# EAGLE design PETKey_Arduino (EAGLE 7.7.0)
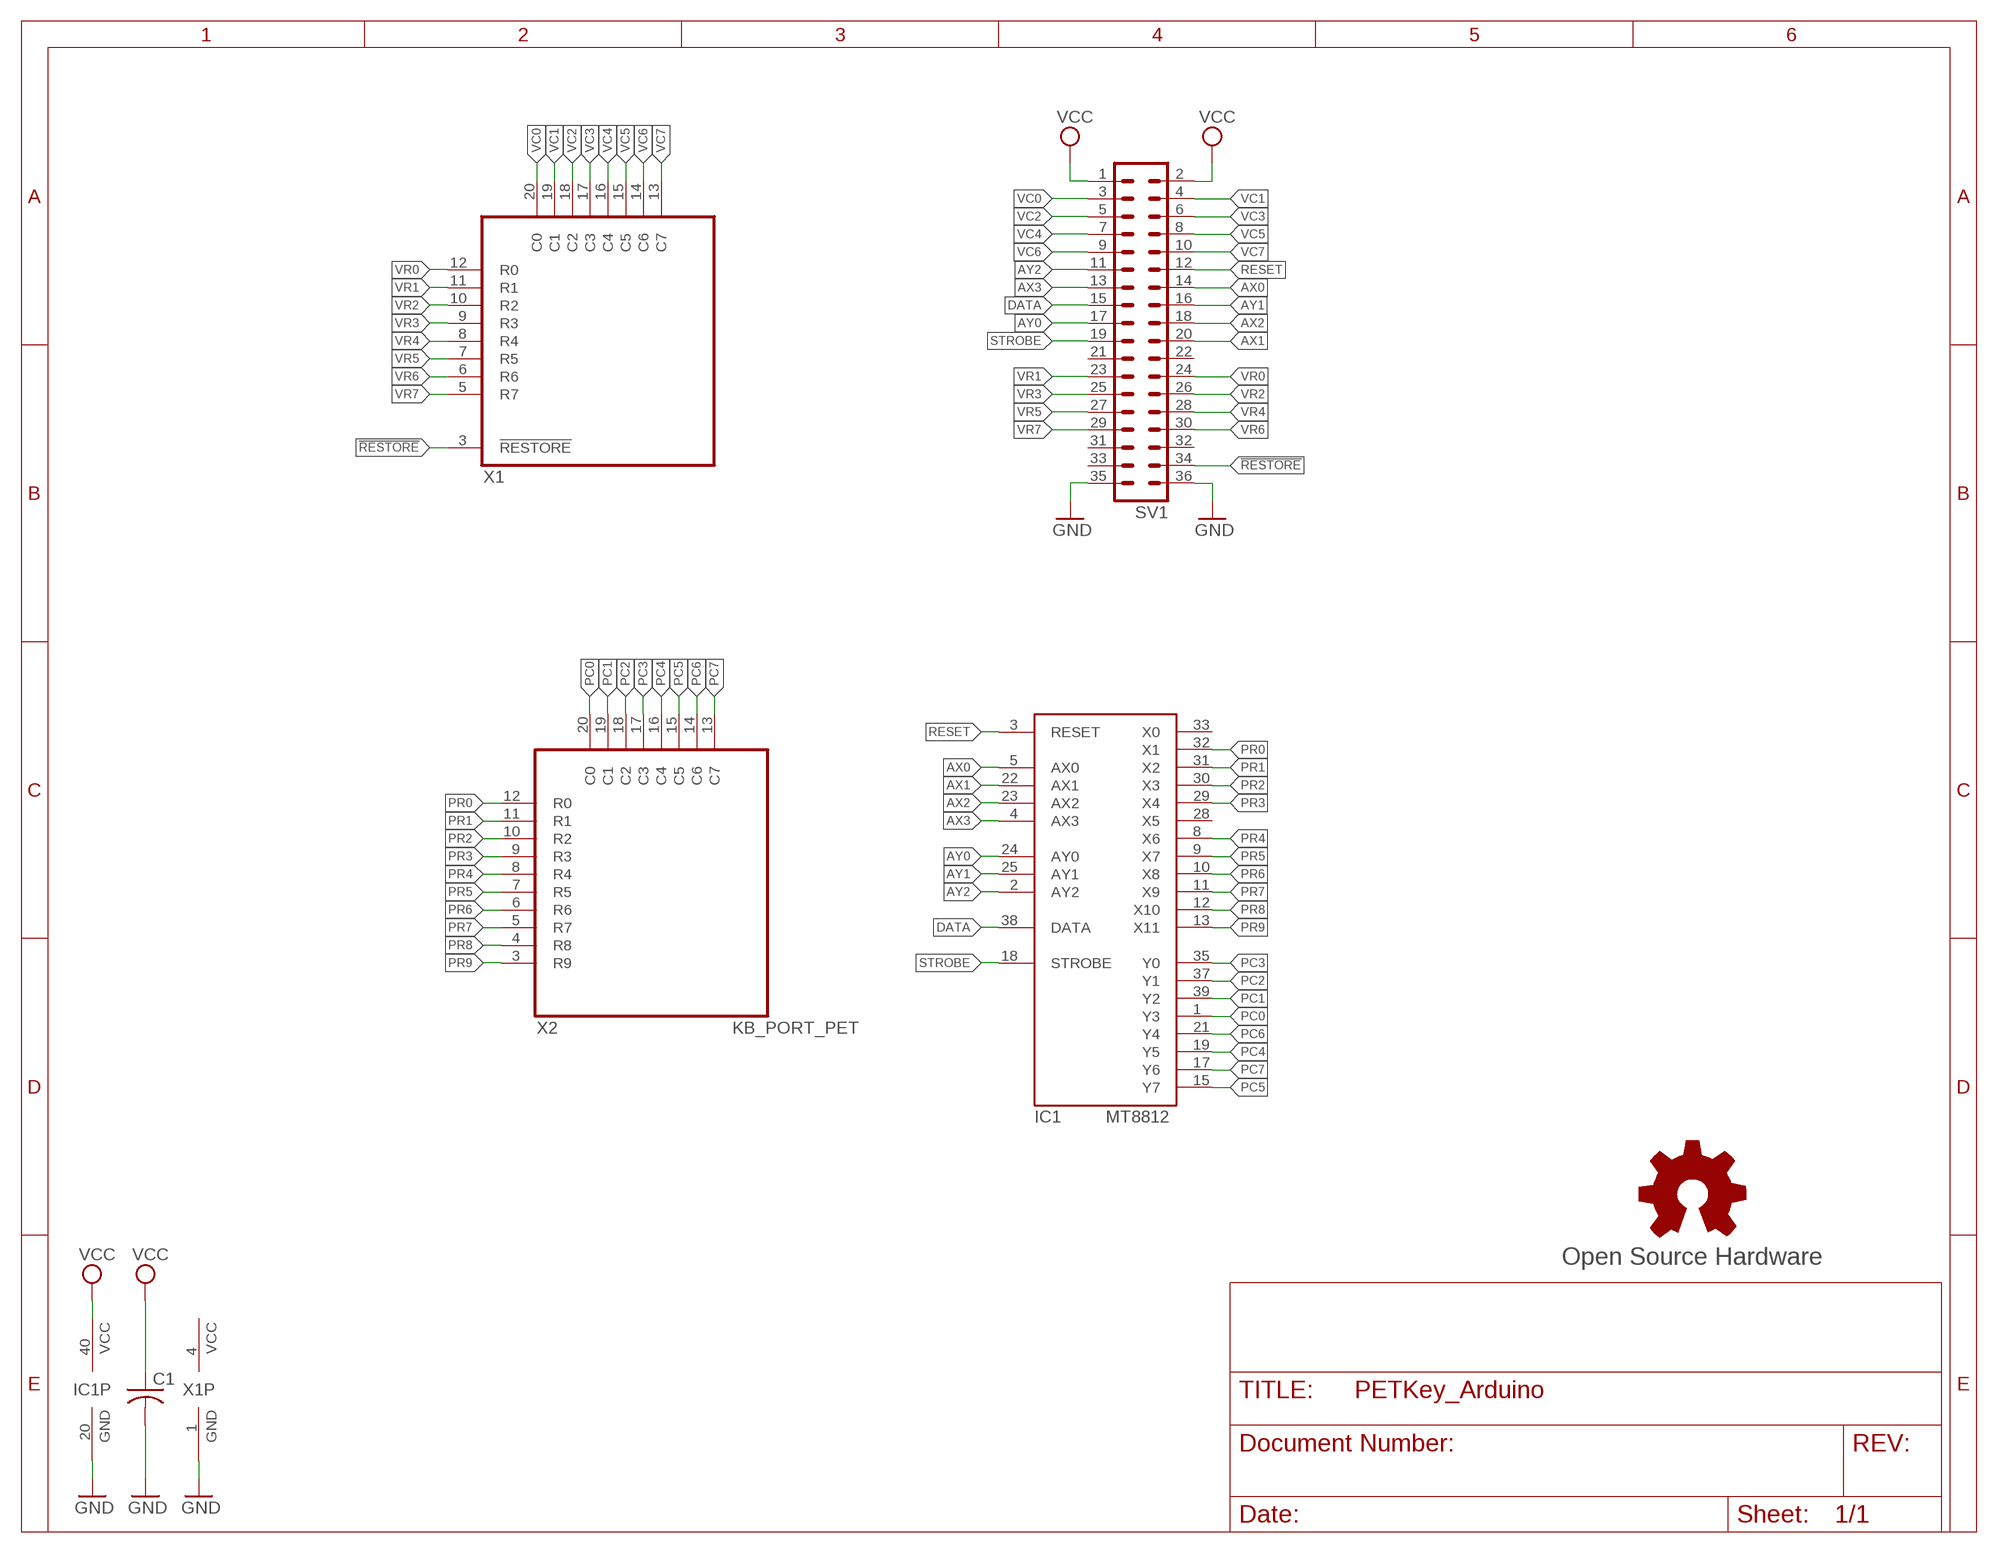
[diagram p0: schematic, sheet 1]

## Parts
C1  C-US025-025X050  [C025-025X050]
GOLD_ORB_SM1  Open Source Hardware  OSHWLOGOLOGO8MM  [OSHW_8MM]
IC1  MT8812  [DIP40]
SV1  MA18-2  [MA18-2]
X1  KB_PORT_VIC/64  [MA20-1_KEYED]
X2  KB_PORT_PET  [MA20-1_KEYED]

## Nets
!RESTORE: SV1.34 X1.3(!RESTORE)
AX0: IC1.5(AX0) SV1.14
AX1: IC1.22(AX1) SV1.20
AX2: IC1.23(AX2) SV1.18
AX3: IC1.4(AX3) SV1.13
AY0: IC1.24(AY0) SV1.17
AY1: IC1.25(AY1) SV1.16
AY2: IC1.2(AY2) SV1.11
DATA: IC1.38(DATA) SV1.15
GND: C1.2 IC1.20(GND) SV1.35 SV1.36 X1.1(GND)
PC0: IC1.1(Y3) X2.20(C0)
PC1: IC1.39(Y2) X2.19(C1)
PC2: IC1.37(Y1) X2.18(C2)
PC3: IC1.35(Y0) X2.17(C3)
PC4: IC1.19(Y5) X2.16(C4)
PC5: IC1.15(Y7) X2.15(C5)
PC6: IC1.21(Y4) X2.14(C6)
PC7: IC1.17(Y6) X2.13(C7)
PR0: IC1.32(X1) X2.12(R0)
PR1: IC1.31(X2) X2.11(R1)
PR2: IC1.30(X3) X2.10(R2)
PR3: IC1.29(X4) X2.9(R3)
PR4: IC1.8(X6) X2.8(R4)
PR5: IC1.9(X7) X2.7(R5)
PR6: IC1.10(X8) X2.6(R6)
PR7: IC1.11(X9) X2.5(R7)
PR8: IC1.12(X10) X2.4(R8)
PR9: IC1.13(X11) X2.3(R9)
RESET: IC1.3(RESET) SV1.12
STROBE: IC1.18(STROBE) SV1.19
VC0: SV1.3 X1.20(C0)
VC1: SV1.4 X1.19(C1)
VC2: SV1.5 X1.18(C2)
VC3: SV1.6 X1.17(C3)
VC4: SV1.7 X1.16(C4)
VC5: SV1.8 X1.15(C5)
VC6: SV1.9 X1.14(C6)
VC7: SV1.10 X1.13(C7)
VCC: C1.1 IC1.40(VCC) SV1.1 SV1.2
VR0: SV1.24 X1.12(R0)
VR1: SV1.23 X1.11(R1)
VR2: SV1.26 X1.10(R2)
VR3: SV1.25 X1.9(R3)
VR4: SV1.28 X1.8(R4)
VR5: SV1.27 X1.7(R5)
VR6: SV1.30 X1.6(R6)
VR7: SV1.29 X1.5(R7)
Unconnected: IC1.28(X5) IC1.33(X0) SV1.21 SV1.22 SV1.31 SV1.32 SV1.33

## Power pins joined to a net without a drawn wire
GND: X2.1(GND)
VCC: X1.4(VCC)

## Library data of the parts
C1 = resistor:C-US: CAPACITOR, American symbol
GOLD_ORB_SM1 = oshw:OSHWLOGO: The OSHW logo for PCB layout
IC1 = MT8812:MT8812
SV1 = con-lstb-rp:MA18-2: PIN HEADER; OC_FARNELL: unknown; OC_NEWARK: unknown
X1 = commodore:KB_PORT_VIC/64: PIN HEADER; OC_FARNELL: unknown; OC_NEWARK: unknown
X2 = commodore:KB_PORT_PET

## Board
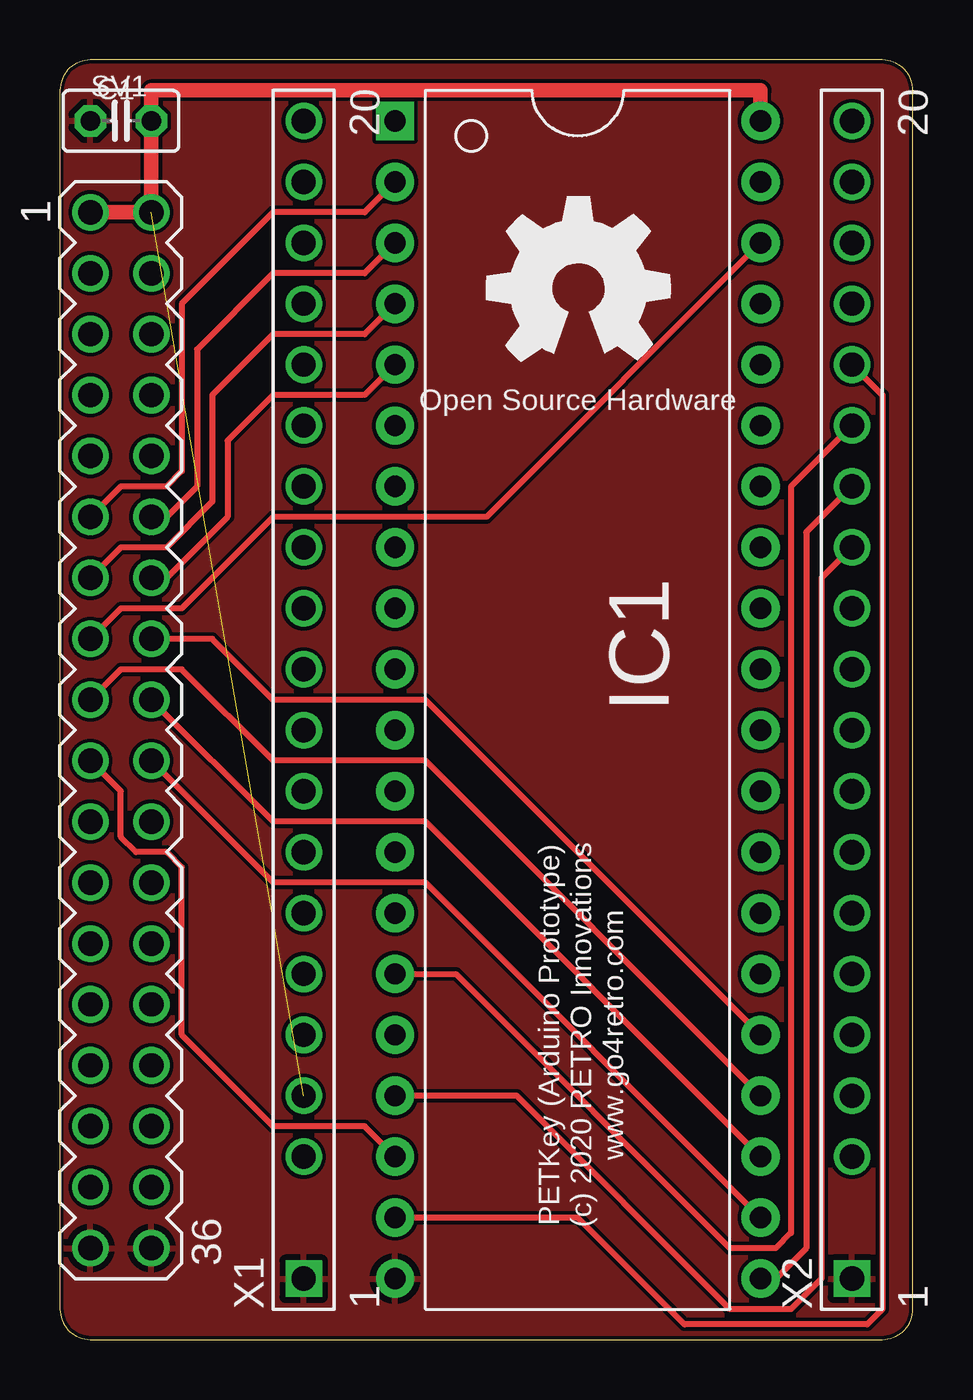
[diagram p1: board, top side]
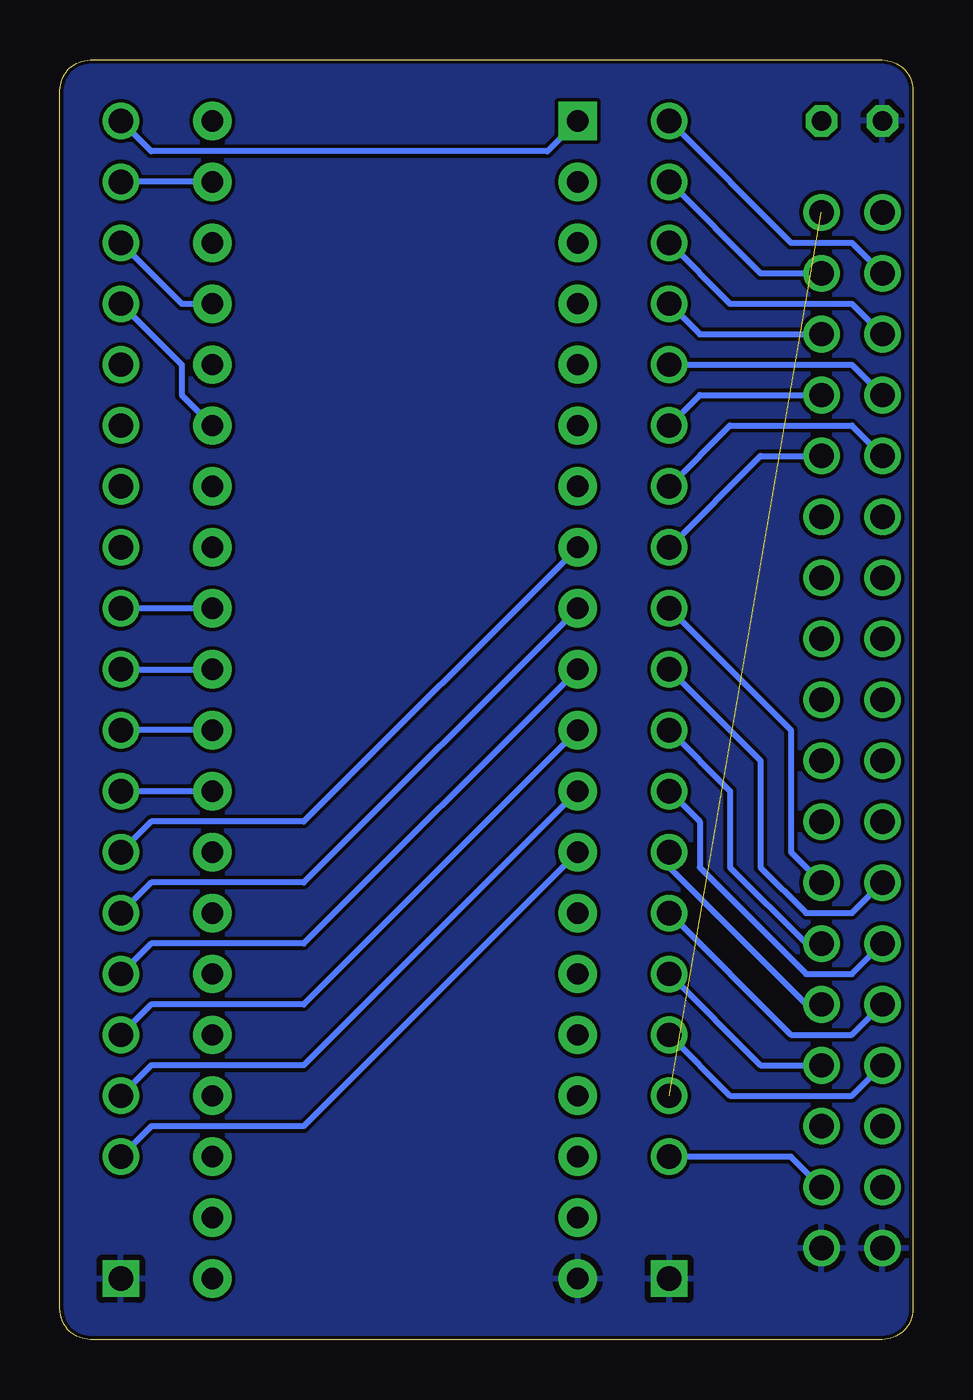
[diagram p2: board, bottom side, seen from below]

Size 35.56 x 53.34 mm. Coordinates in mm from the lower left corner, seen from the top.
Outline: 0,52.07 0,1.27 arc90 1.27,0 34.29,0 arc90 35.56,1.27 35.56,52.07 arc90 34.29,53.34 1.27,53.34 arc90 0,52.07
Copper layers (1*16): Top 0.035mm / dielectric 1.5mm / Bottom 0.035mm
Design rules "hackvana": minimum track width 6mil, minimum drill 0.3mm, track to track 6mil, track to pad 6mil, pad to pad 6mil, via to via 6mil, smd to smd 0mil, copper to edge 6mil, drill to drill 6mil, minimum pad ring 10mil, minimum via ring 6mil, stop-mask expansion 2mil, vias tented up to drill 100mil, thermal gap 10mil

### Footprints (pad centres in the part's own frame; a part is rotated, then mirrored left to right if it is on the bottom)
C025-025X050 = drill 0.813 octagon: 1 -1.27,0; 2 1.27,0
DIP40 = drill 0.889 pad 1.6 square: 1 -22.86,-7.62 | drill 0.889 pad 1.6: 2 -20.32,-7.62; 3 -17.78,-7.62; 4 -15.24,-7.62; 5 -12.7,-7.62; 6 -10.16,-7.62; 7 -7.62,-7.62; 8 -5.08,-7.62; 9 -2.54,-7.62; 10 0,-7.62; 11 2.54,-7.62; 12 5.08,-7.62; 13 7.62,-7.62; 14 10.16,-7.62; 15 12.7,-7.62; 16 15.24,-7.62; 17 17.78,-7.62; 18 20.32,-7.62; 19 22.86,-7.62; 20 25.4,-7.62; 21 25.4,7.62; 22 22.86,7.62; 23 20.32,7.62; 24 17.78,7.62; 25 15.24,7.62; 26 12.7,7.62; 27 10.16,7.62; 28 7.62,7.62; 29 5.08,7.62; 30 2.54,7.62; 31 0,7.62; 32 -2.54,7.62; 33 -5.08,7.62; 34 -7.62,7.62; 35 -10.16,7.62; 36 -12.7,7.62; 37 -15.24,7.62; 38 -17.78,7.62; 39 -20.32,7.62; 40 -22.86,7.62
MA18-2 = drill 1.016: 1 -21.59,-1.27; 2 -21.59,1.27; 3 -19.05,-1.27; 4 -19.05,1.27; 5 -16.51,-1.27; 6 -16.51,1.27; 7 -13.97,-1.27; 8 -13.97,1.27; 9 -11.43,-1.27; 10 -11.43,1.27; 11 -8.89,-1.27; 12 -8.89,1.27; 13 -6.35,-1.27; 14 -6.35,1.27; 15 -3.81,-1.27; 16 -3.81,1.27; 17 -1.27,-1.27; 18 -1.27,1.27; 19 1.27,-1.27; 20 1.27,1.27; 21 3.81,-1.27; 22 3.81,1.27; 23 6.35,-1.27; 24 6.35,1.27; 25 8.89,-1.27; 26 8.89,1.27; 27 11.43,-1.27; 28 11.43,1.27; 29 13.97,-1.27; 30 13.97,1.27; 31 16.51,-1.27; 32 16.51,1.27; 33 19.05,-1.27; 34 19.05,1.27; 35 21.59,-1.27; 36 21.59,1.27
MA20-1_KEYED = drill 1.016 square: 1 -24.13,0 | drill 1.016: 3 -19.05,0; 4 -16.51,0; 5 -13.97,0; 6 -11.43,0; 7 -8.89,0; 8 -6.35,0; 9 -3.81,0; 10 -1.27,0; 11 1.27,0; 12 3.81,0; 13 6.35,0; 14 8.89,0; 15 11.43,0; 16 13.97,0; 17 16.51,0; 18 19.05,0; 19 21.59,0; 20 24.13,0

### Placement (x,y rotation side)
C1  2.54,50.8 180 top
GOLD_ORB_SM1  21.59,43.81 0 top
IC1  21.59,27.94 270 top
SV1  2.54,25.4 270 top
X1  10.16,26.67 90 top
X2  33.02,26.67 90 top

### Tracks (layer width: path | path; a pad name or v marks a point on that pad's centre or on a via)
!RESTORE
  Bottom 0.254: SV1.34 5.08,7.62 X1.3
AX0
  Top 0.254: IC1.5 12.7,39.37 8.89,39.37 6.99,37.46 6.99,34.29 4.45,31.75 SV1.14
AX1
  Top 0.254: IC1.22 15.24,19.05 8.89,19.05 SV1.20
AX2
  Top 0.254: IC1.23 15.24,21.59 8.89,21.59 SV1.18
AX3
  Top 0.254: IC1.4 12.7,41.91 8.89,41.91 6.35,39.37 6.35,34.92 4.45,33.02 2.54,33.02 SV1.13
AY0
  Top 0.254: IC1.24 15.24,24.13 8.89,24.13 5.08,27.94 2.54,27.94 SV1.17
AY1
  Top 0.254: IC1.25 15.24,26.67 8.89,26.67 6.35,29.21 SV1.16
AY2
  Top 0.254: IC1.2 12.7,46.99 8.89,46.99 5.08,43.18 5.08,36.2 4.45,35.56 2.54,35.56 SV1.11
DATA
  Top 0.254: IC1.38 17.78,34.29 8.89,34.29 5.08,30.48 2.54,30.48 SV1.15
GND
  pour Top: 35.56,52.07 35.56,1.27 arc-90 34.29,0 1.27,0 arc-90 0,1.27 0,52.07 arc-90 1.27,53.34 34.29,53.34 arc-90
  pour Bottom: 35.56,52.07 35.56,1.27 arc-90 34.29,0 1.27,0 arc-90 0,1.27 0,52.07 arc-90 1.27,53.34 34.29,53.34 arc-90
PC0
  Bottom 0.254: IC1.1 15.24,49.53 31.75,49.53 X2.20
PC1
  Bottom 0.254: IC1.39 X2.19
PC2
  Bottom 0.254: X2.18 30.48,43.18 IC1.37
PC3
  Bottom 0.254: X2.17 30.48,40.64 30.48,39.37 IC1.35
PC4
  Top 0.254: X2.16 34.29,39.37 34.29,1.27 33.66,0.64 26.04,0.64 21.59,5.08 IC1.19
PC5
  Top 0.254: X2.15 30.48,35.56 30.48,4.45 29.84,3.81 27.94,3.81 16.51,15.24 IC1.15
PC6
  Top 0.254: X2.14 31.11,33.66 31.11,3.81 29.84,2.54 IC1.21
PC7
  Top 0.254: X2.13 31.75,31.75 31.75,2.54 30.48,1.27 27.94,1.27 19.05,10.16 IC1.17
PR0
  Bottom 0.254: IC1.32 X2.12
PR1
  Bottom 0.254: X2.11 IC1.31
PR2
  Bottom 0.254: IC1.30 X2.10
PR3
  Bottom 0.254: X2.9 IC1.29
PR4
  Bottom 0.254: IC1.8 25.4,21.59 31.75,21.59 X2.8
PR5
  Bottom 0.254: IC1.9 25.4,19.05 31.75,19.05 X2.7
PR6
  Bottom 0.254: IC1.10 25.4,16.51 31.75,16.51 X2.6
PR7
  Bottom 0.254: IC1.11 25.4,13.97 31.75,13.97 X2.5
PR8
  Bottom 0.254: IC1.12 25.4,11.43 31.75,11.43 X2.4
PR9
  Bottom 0.254: IC1.13 25.4,8.89 31.75,8.89 X2.3
RESET
  Top 0.254: IC1.3 12.7,44.45 8.89,44.45 5.71,41.27 5.71,35.56 4.45,34.29 SV1.12
STROBE
  Top 0.254: IC1.18 12.7,8.89 8.89,8.89 5.08,12.7 5.08,19.68 4.45,20.32 3.17,20.32 2.54,20.95 2.54,22.86 SV1.19
VC0
  Bottom 0.254: X1.20 5.08,45.72 2.54,45.72 SV1.3
VC1
  Bottom 0.254: X1.19 6.35,44.45 SV1.4
VC2
  Bottom 0.254: X1.18 7.62,43.18 2.54,43.18 SV1.5
VC3
  Bottom 0.254: X1.17 8.89,41.91 SV1.6
VC4
  Bottom 0.254: X1.16 2.54,40.64 SV1.7
VC5
  Bottom 0.254: X1.15 8.89,39.37 SV1.8
VC6
  Bottom 0.254: X1.14 7.62,38.1 2.54,38.1 SV1.9
VC7
  Bottom 0.254: X1.13 6.35,36.83 SV1.10
VCC  (1 unrouted)
  Top 0.61: SV1.1 SV1.2 C1.1 3.81,52.07 29.21,52.07 IC1.40
VR0
  Bottom 0.254: X1.12 5.08,25.4 5.08,20.32 SV1.24
VR1
  Bottom 0.254: X1.11 6.35,24.13 6.35,19.68 4.45,17.78 2.54,17.78 SV1.23
VR2
  Bottom 0.254: X1.10 7.62,22.86 7.62,19.68 4.45,16.51 SV1.26
VR3
  Bottom 0.254: X1.9 8.89,21.59 8.89,19.68 4.45,15.24 2.54,15.24 SV1.25
VR4
  Bottom 0.254: X1.8 10.16,19.68 4.45,13.97 SV1.28
VR5
  Bottom 0.254: X1.7 5.08,12.7 2.54,12.7 SV1.27
VR6
  Bottom 0.254: X1.6 6.35,11.43 SV1.30
VR7
  Bottom 0.254: X1.5 7.62,10.16 2.54,10.16 SV1.29

### Text on the board
tNames: PETKey (Arduino Prototype) / (c) 2020 RETRO Innovations / www.go4retro.com